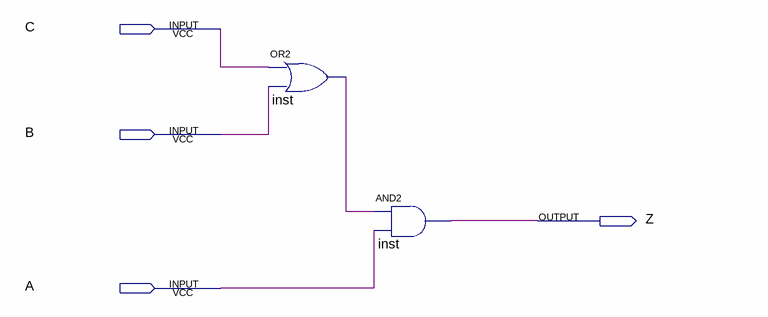
[diagram p0: schematic sheet]
// Quartus schematic ex1.bdf as structural Verilog: 2 symbols, 4 pins
module ex1 (
  input  C,
  input  B,
  input  A,
  output Z
);

  wire inst_out;

  or inst (inst_out, C, B);
  and inst_dup2 (Z, inst_out, A);
endmodule
